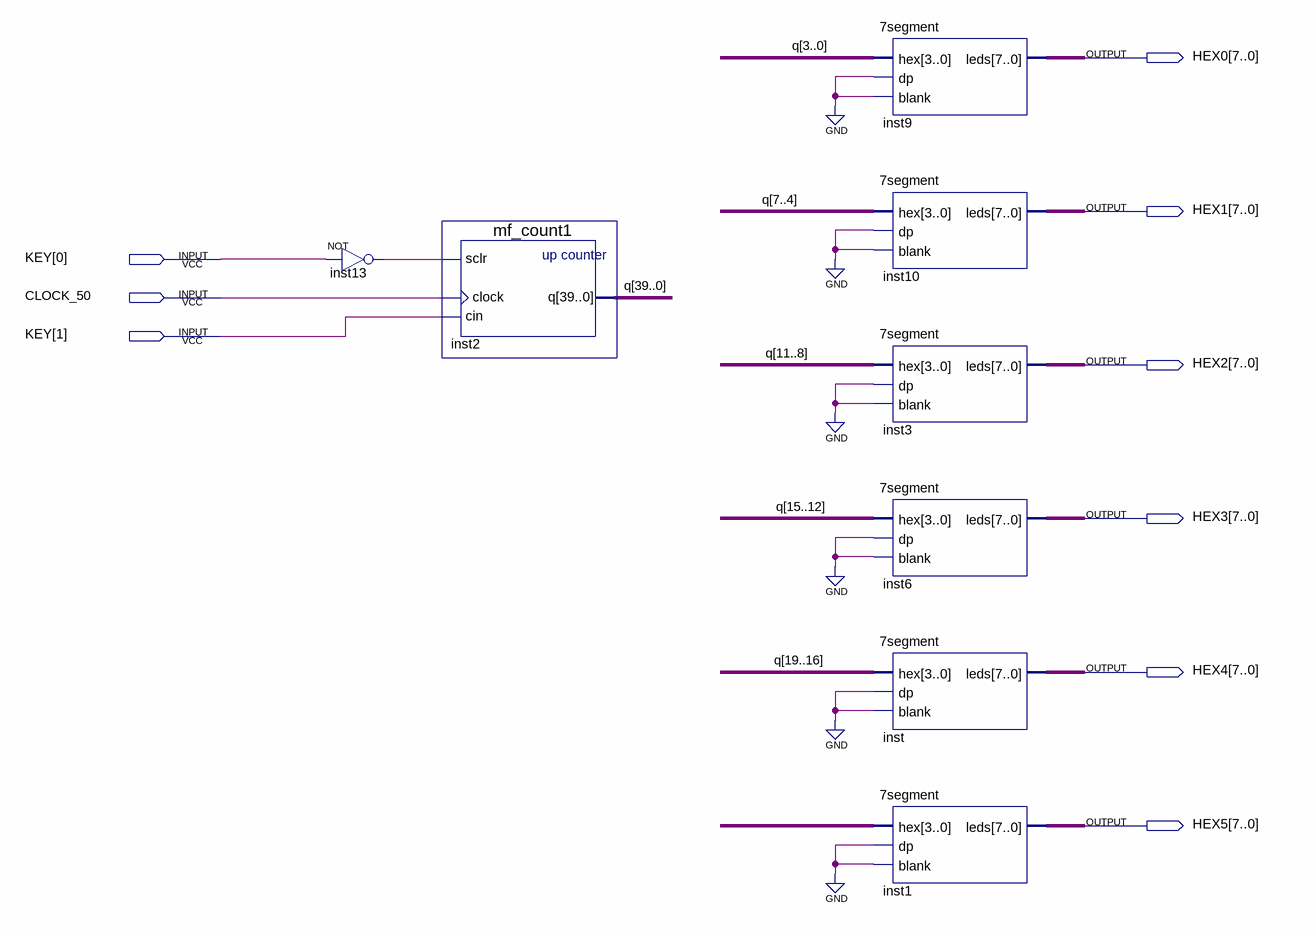
[diagram p0: schematic sheet]
// Quartus schematic Counter.bdf as structural Verilog: 8 symbols, 9 pins
module Counter (
  input  [1:0] KEY,
  input  CLOCK_50,
  output [7:0] HEX0,
  output [7:0] HEX1,
  output [7:0] HEX2,
  output [7:0] HEX3,
  output [7:0] HEX4,
  output [7:0] HEX5
);

  wire inst13_out;
  wire [3:0] undriven;
  wire [39:0] q;

  not inst13 (inst13_out, KEY[0]);
  mf_count1 inst2 (.sclr(inst13_out), .clock(CLOCK_50), .cin(KEY[1]), .q(q));
  \7segment  inst9 (.hex(q[3:0]), .dp(1'b0), .blank(1'b0), .leds(HEX0));
  \7segment  inst10 (.hex(q[7:4]), .dp(1'b0), .blank(1'b0), .leds(HEX1));
  \7segment  inst3 (.hex(q[11:8]), .dp(1'b0), .blank(1'b0), .leds(HEX2));
  \7segment  inst6 (.hex(q[15:12]), .dp(1'b0), .blank(1'b0), .leds(HEX3));
  \7segment  inst (.hex(q[19:16]), .dp(1'b0), .blank(1'b0), .leds(HEX4));
  \7segment  inst1 (.hex(undriven), .dp(1'b0), .blank(1'b0), .leds(HEX5));
endmodule
